# EAGLE design Power_Socket_nrf24_mini (EAGLE 6.2)
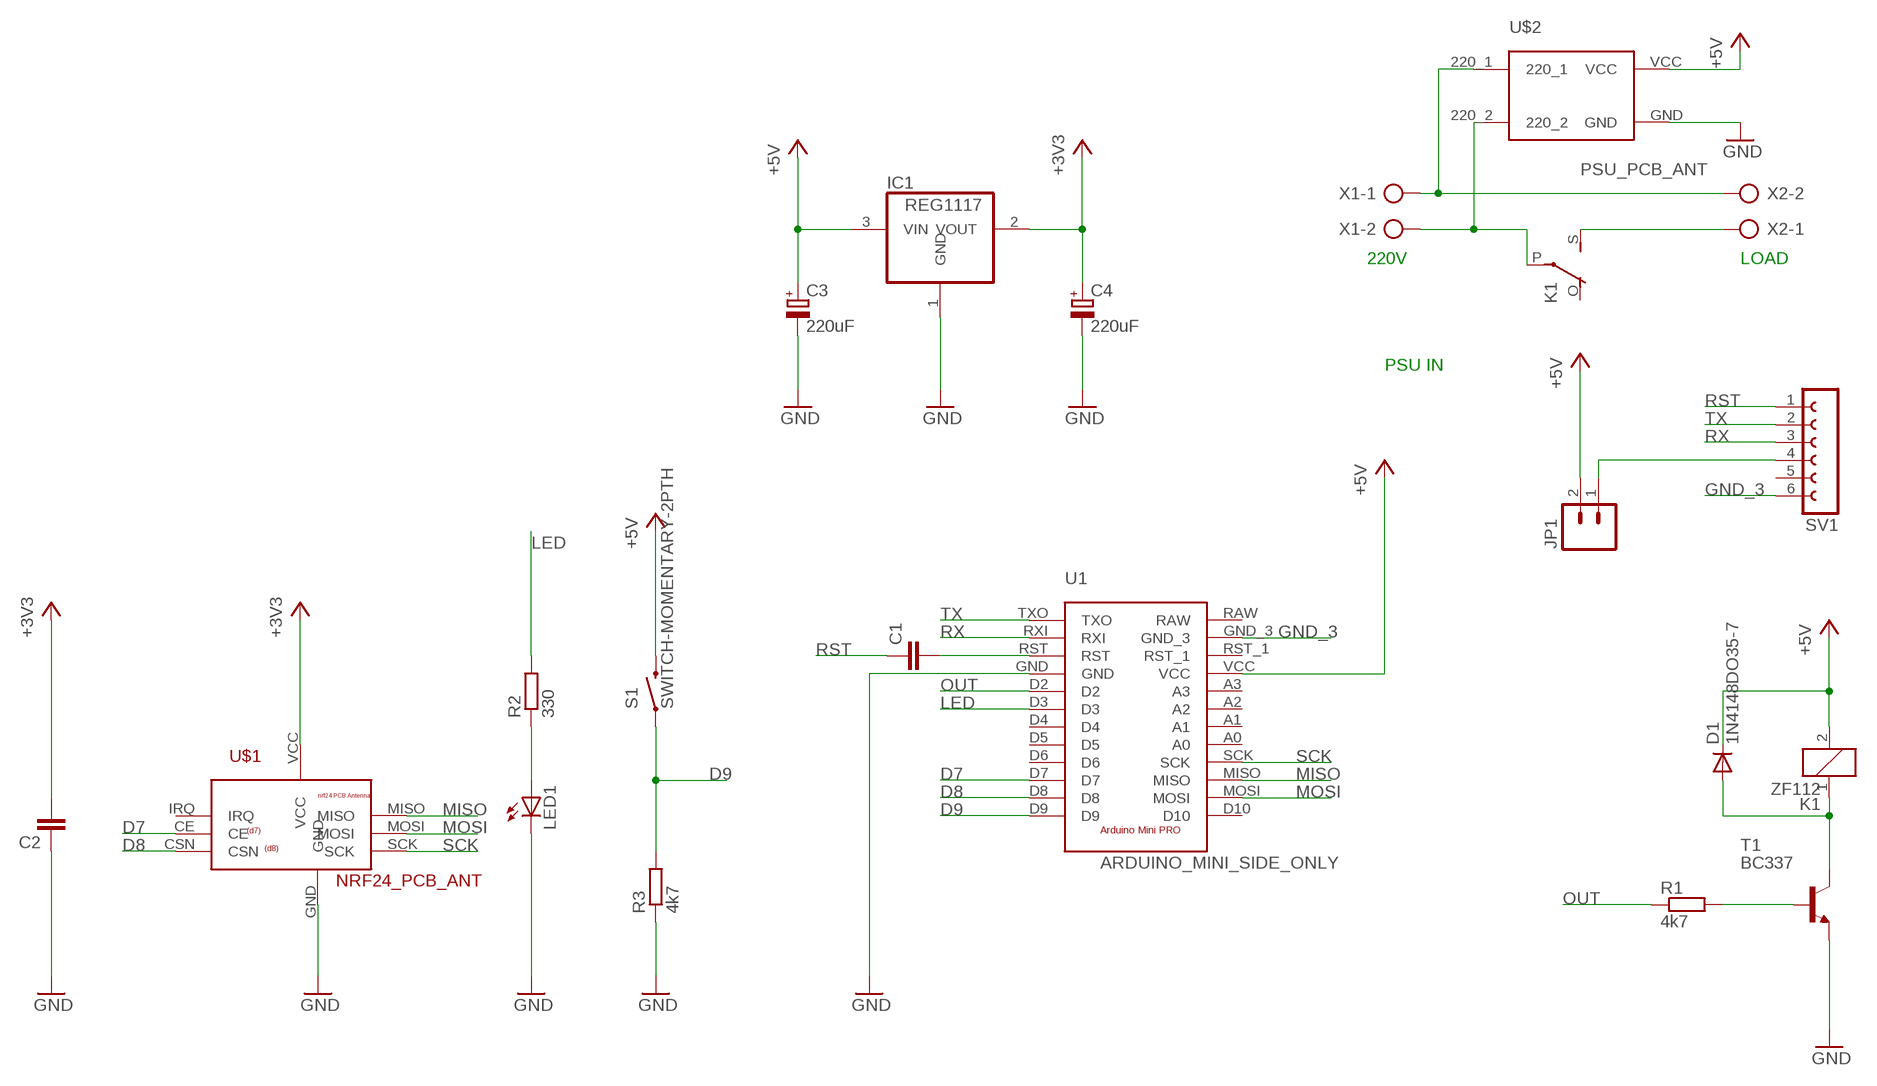
[diagram p0: schematic, sheet 1]

## Parts
C1  C-EUC1206  [C1206]
C2  C-EUC1206  [C1206]
C3  220uF  CPOL-EUE2.5-6  [E2,5-6]
C4  220uF  CPOL-EUE2.5-6  [E2,5-6]
D1  1N4148DO35-7  [DO35-7]
IC1  REG1117  [SOT223]
JP1  M02  [1X02_LONGPADS]
K1  ZF112  [ZF112]
LED1  LED3MM  [LED3MM]
R1  4k7  R-EU_0207/10  [0207/10]
R2  330  R-EU_0207/10  [0207/10]
R3  4k7  R-EU_0207/10  [0207/10]
S1  SWITCH-MOMENTARY-2PTH  [TACTILE-PTH]
SV1  FE06-1  [FE06]
T1  BC337  [TO92]
U1  ARDUINO_MINI_SIDE_ONLY  [ARDUINO_MINI_PRO_SIDE_ONLY]
U$1  NRF24_PCB_ANT  [NRF24_PCB_ANT]
U$2  PSU_PCB_ANT  [PSU_PCB_600MA]
X1  AK300/2  [AK300/2]
X2  AK300/2  [AK300/2]

## Nets
+3V3: C2.2 C4.+ IC1.2(VOUT) U$1.VCC
+5V: C3.+ D1.C IC1.3(VIN) JP1.2 K1.2 S1.3 U1.VCC U$2.VCC
D7: U1.D7 U$1.CE
D8: U1.D8 U$1.CSN
D9: R3.2 S1.1 U1.D9
GND: C2.1 C3.- C4.- IC1.1(GND) LED1.K(C) R3.1 T1.1(E) U1.GND U$1.GND U$2.GND
GND_3: SV1.6 U1.GND_3
LED: R2.2 U1.D3
MISO: U1.MISO U$1.MISO
MOSI: U1.MOSI U$1.MOSI
N$1: U$2.220_1 X1.1 X2.2
N$2: K1.P(2:P) U$2.220_2 X1.2
N$3: K1.S(2:S) X2.1
N$4: D1.A K1.1 T1.3(C)
N$5: R1.2 T1.2(B)
N$6: JP1.1 SV1.4
N$7: C1.2 U1.RST
N$8: LED1.A R2.1
OUT: R1.1 U1.D2
RST: C1.1 SV1.1
RX: SV1.3 U1.RXI
SCK: U1.SCK U$1.SCK
TX: SV1.2 U1.TXO
Unconnected: K1.O(2:O) SV1.5 U1.A0 U1.A1 U1.A2 U1.A3 U1.D4 U1.D5 U1.D6 U1.D10 U1.RAW U1.RST_1 U$1.IRQ

## Notes on the sheet
- 220V | LOAD
- PSU IN

## Library data of the parts
C1 C2 = resistor:C-EU: CAPACITOR, European symbol
C3 C4 = resistor:CPOL-EU: POLARIZED CAPACITOR, European symbol
D1 = diode:1N4148: DIODE high speed (Philips)
IC1 = burr-brown:REG1117: 800mA and 1A Low Dropout (LDO) Positive Regulator 1.8V, 2.5V, 2.85V, 3.3V, 5V, and Adj; MPN: REG1117; OC_FARNELL: 1097566; OC_NEWARK: 14P6981
JP1 = SparkFun:M02: Header 2 Standard 2-pin 0.1" header. Use with straight break away headers (SKU : PRT-00116), right angle break away headers (PRT-00553), swiss pins (PRT-00743), machine pins (PRT-00117), and female headers (PRT-00115). Molex polarized connector foot print use with SKU : PRT-08233 with associated crimp pins and housings.
K1 = relay:ZF112: RELAY 1 x switch; OC_FARNELL: unknown; OC_NEWARK: unknown
LED1 = led:LED: LED OSRAM: - CHIPLED LG R971, LG N971, LY N971, LG Q971, LY Q971, LO R971, LY R971 LH N974, LH R974 LS Q976, LO Q976, LY Q976 LO Q996 - Hyper CHIPLED LW Q18S LB Q993, LB Q99A, LB R99A - SideLED LS A670, LO A670, LY A670, LG A670, LP A670 LB A673, LV A673, LT A673, LW A673 LH A674 LY A675 LS A676, LA A676, LO A676, LY A676, LW A676 LS A679, LY A679, LG A679 - Hyper Micro SIDELED® LS Y876, LA Y876, LO Y876, LY Y876 LT Y87S - SmartLED LW L88C, LW L88S LB L89C, LB L89S, LG L890 LS L89K, LO L89K, LY L89K LS L896, LA L896, LO L896, LY L896 - TOPLED LS T670, LO T670, LY T670, LG T670, LP T670 LSG T670, LSP T670, LSY T670, LOP T670, LYG T670 LG T671, LOG T671, LSG T671 LB T673, LV T673, LT T673, LW T673 LH T674 LS T676, LA T676, LO T676, LY T676, LB T676, LH T676, LSB T676, LW T676 LB T67C, LV T67C, LT T67C, LS T67K, LO T67K, LY T67K, LW E67C LS E67B, LA E67B, LO E67B, LY E67B, LB E67C, LV E67C, LT E67C LW T67C LS T679, LY T679, LG T679 LS T770, LO T770, LY T770, LG T770, LP T770 LB T773, LV T773, LT T773, LW T773 LH T774 LS E675, LA E675, LY E675, LS T675 LS T776, LA T776, LO T776, LY T776, LB T776 LHGB T686 LT T68C, LB T68C - Hyper Mini TOPLED® LB M676 - Mini TOPLED Santana® LG M470 LS M47K, LO M47K, LY M47K Source: http://www.osram.convergy.de LUXEON: - LUMILED® LXK2-PW12-R00, LXK2-PW12-S00, LXK2-PW14-U00, LXK2-PW14-V00 LXK2-PM12-R00, LXK2-PM12-S00, LXK2-PM14-U00 LXK2-PE12-Q00, LXK2-PE12-R00, LXK2-PE12-S00, LXK2-PE14-T00, LXK2-PE14-U00 LXK2-PB12-K00, LXK2-PB12-L00, LXK2-PB12-M00, LXK2-PB14-N00, LXK2-PB14-P00, LXK2-PB14-Q00 LXK2-PR12-L00, LXK2-PR12-M00, LXK2-PR14-Q00, LXK2-PR14-R00 LXK2-PD12-Q00, LXK2-PD12-R00, LXK2-PD12-S00 LXK2-PH12-R00, LXK2-PH12-S00 LXK2-PL12-P00, LXK2-PL12-Q00, LXK2-PL12-R00 Source: www.luxeon.com KINGBRIGHT: KA-3528ASYC Source: www.kingbright.com
R1-R3 = resistor:R-EU_: RESISTOR, European symbol
S1 = SparkFun:SWITCH-MOMENTARY-2
SV1 = con-lsta:FE06-1: FEMALE HEADER; OC_FARNELL: unknown; OC_NEWARK: unknown
T1 = transistor:BC337: NPN TRANSISTOR
U1 = MyArduino:ARDUINO_MINI_SIDE_ONLY
U$1 = my_components:NRF24_PCB_ANT
U$2 = my_components:PSU_PCB_ANT
X1 X2 = con-ptr500:AK300/2: CONNECTOR; OC_FARNELL: unknown; OC_NEWARK: unknown

## Board
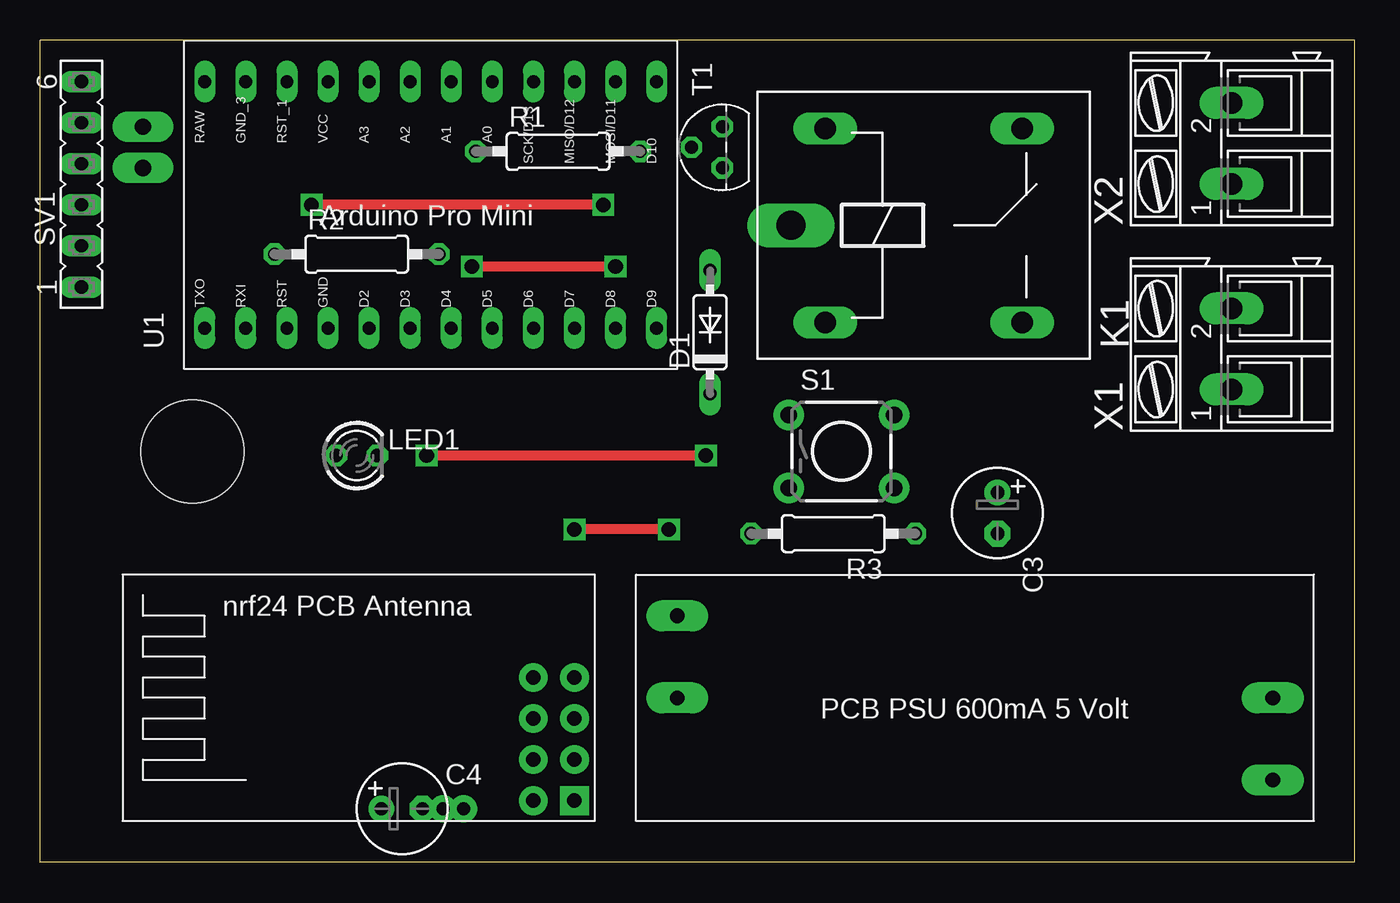
[diagram p1: board, top side]
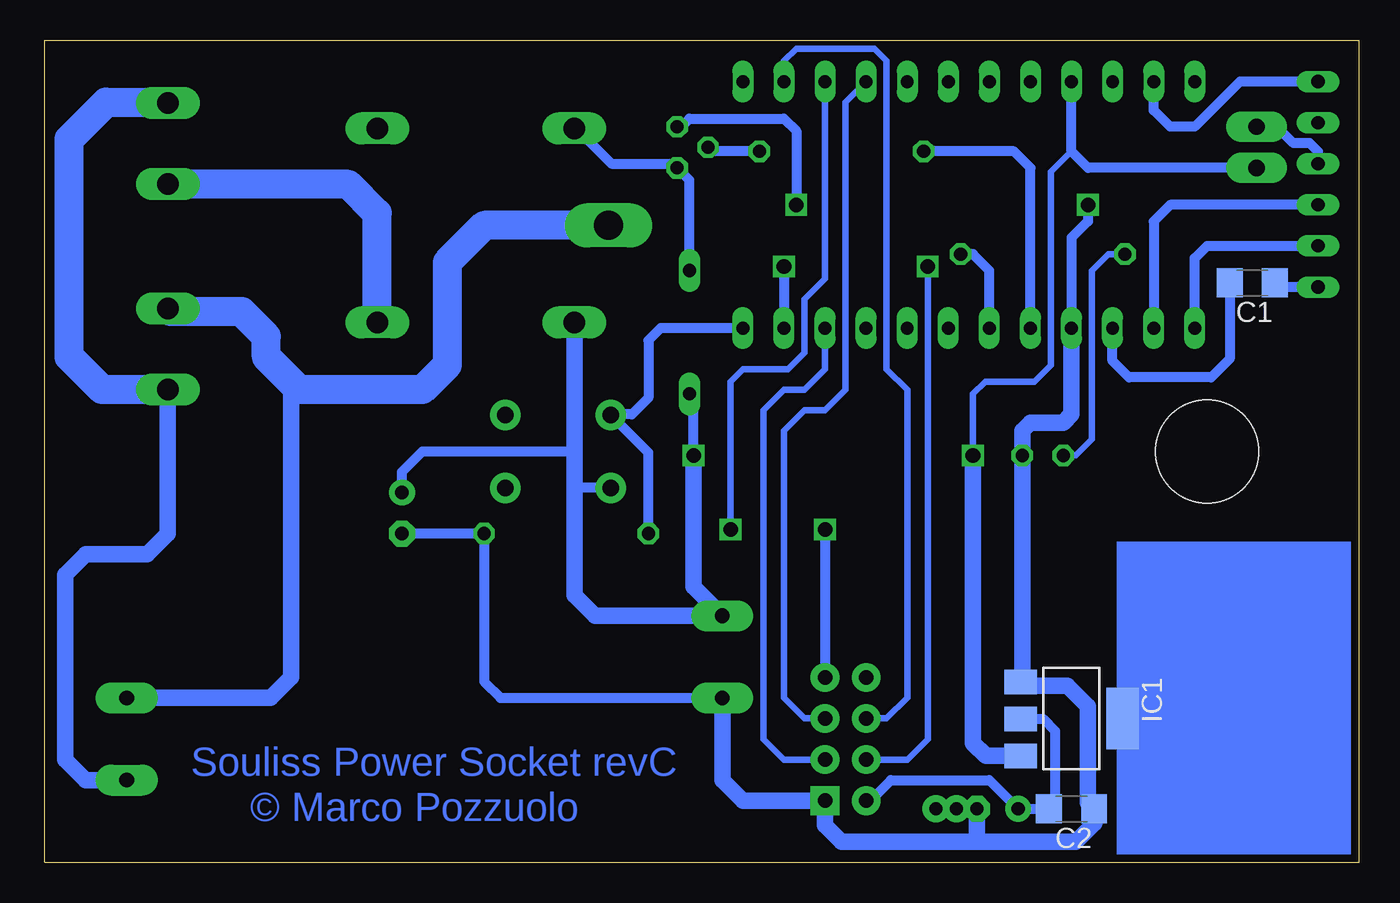
[diagram p2: board, bottom side, seen from below]

Size 81.28 x 50.8 mm. Coordinates in mm from the lower left corner, seen from the top.
Outline: 81.28,0 0,0 0,50.8 81.28,50.8 81.28,0
Copper layers (1*16): Top 0.035mm / dielectric 1.5mm / Bottom 0.035mm
Design rules: minimum track width 10mil, minimum drill 24mil, track to track 8mil, track to pad 8mil, pad to pad 8mil, via to via 8mil, smd to smd 8mil, copper to edge 40mil, drill to drill 8mil, minimum pad ring 10mil, minimum via ring 8mil, stop-mask expansion 4mil, vias tented up to drill 0mil, thermal gap 10mil
Holes 6.35 mm at 9.4,25.4

### Footprints (pad centres in the part's own frame; a part is rotated, then mirrored left to right if it is on the bottom)
C1206 = smd 1.6 x 1.8: 1 -1.4,0; 2 1.4,0
E2,5-6 = drill 0.813 pad 1.6: + -1.27,0 | drill 0.813 pad 1.6 octagon: - 1.27,0
DO35-7 = drill 0.813 long: A 3.81,0; C -3.81,0
SOT223 = smd 1.499 x 2.007: 1 -2.261,-3.15; 2 0.025,-3.15; 3 2.311,-3.15 | smd 3.81 x 2.007: 4 0,3.15
1X02_LONGPADS = drill 1.016 pad 1.88 long: 1 0,0; 2 2.54,0
ZF112 = drill 1.321 long: 1 -6.096,5.994; 2 -6.096,-5.994; O 6.096,5.994; S 6.096,-5.994 | drill 1.803 long: P -8.204,0
LED3MM = drill 0.813 octagon: A -1.27,0; K 1.27,0
0207/10 = drill 0.813 octagon: 1 -5.08,0; 2 5.08,0
TACTILE-PTH = drill 1.016 pad 1.88: 1 -3.251,2.261; 2 3.251,2.261; 3 -3.251,-2.261; 4 3.251,-2.261
FE06 = drill 0.813 long: 1 -6.35,0; 2 -3.81,0; 3 -1.27,0; 4 1.27,0; 5 3.81,0; 6 6.35,0
TO92 = drill 0.813 octagon: 1 1.27,0; 2 0,1.905; 3 -1.27,0
ARDUINO_MINI_PRO_SIDE_ONLY = drill 0.8 long: A0 7.62,0; A1 7.62,2.54; A2 7.62,5.08; A3 7.62,7.62; D2 -7.62,7.62; D3 -7.62,5.08; D4 -7.62,2.54; D5 -7.62,0; D6 -7.62,-2.54; D7 -7.62,-5.08; D8 -7.62,-7.62; D9 -7.62,-10.16; D10 7.62,-10.16; GND -7.62,10.16; GND_3 7.62,15.24; MISO 7.62,-5.08; MOSI 7.62,-7.62; RAW 7.62,17.78; RST -7.62,12.7; RST_1 7.62,12.7; RXI -7.62,15.24; SCK 7.62,-2.54; TXO -7.62,17.78; VCC 7.62,10.16
NRF24_PCB_ANT = drill 0.9 pad 1.778: CE -6.35,1.27; CSN -3.81,1.27; IRQ -3.81,-3.81; MISO -6.35,-3.81; MOSI -3.81,-1.27; SCK -6.35,-1.27; VCC -3.81,3.81 | drill 0.9 pad 1.778 square: GND -6.35,3.81
PSU_PCB_600MA = drill 0.9 pad 1.93 long: 220_1 2.54,2.54; 220_2 7.62,2.54; GND 7.62,39.37; VCC 12.7,39.37
AK300/2 = drill 1.321 long: 1 -2.515,0; 2 2.489,0

### Placement (x,y rotation side)
C1  6.6,35.81 180 bottom
C2  17.78,3.3 180 bottom
C3  59.18,21.59 270 top
C4  22.35,3.3 0 top
D1  41.4,32.77 90 top
IC1  17.78,8.89 270 bottom
JP1  6.35,45.47 270 top
K1  54.61,39.37 0 top
LED1  19.56,25.15 0 top
R1  32,43.94 0 top
R2  19.56,37.59 0 top
R3  49.02,20.32 180 top
S1  49.53,25.4 0 top
SV1  2.54,41.91 90 top
T1  42.16,44.2 90 top
U1  27.94,40.64 90 top
U$1  26.67,7.62 180 top
U$2  78.74,2.54 90 top
X1  73.66,31.75 90 top
X2  73.66,44.45 90 top

### Tracks (layer width: path | path; a pad name or v marks a point on that pad's centre or on a via)
+3V3
  Bottom 0.61: IC1.2 19.53,8.87 18.8,8.13 18.8,3.69 C2.2 | 19.69,3.81 C2.2 | C2.2 C4.+ 22.86,5.08 28.96,5.08 30.23,3.81 U$1.VCC
+5V  (via drill 0.9)
  Top 0.61: v23.88,25.15 v41.15,25.15
  Bottom 0.406: v23.88,25.15 23.88,28.96 23.11,29.72 20.07,29.72 19.05,30.73 19.05,42.67 17.78,43.94
  Bottom 0.61: JP1.2 16.76,42.93 17.78,43.94 U1.VCC | 48.36,33.53 K1.2 | v41.15,25.15 41.15,28.7 D1.C | S1.3 48.29,23.14 48.51,23.37 | C3.+ 59.18,24.13 57.91,25.4 48.51,25.4
  Bottom 1.016: IC1.3 23.09,6.58 23.88,7.37 v23.88,25.15 | v41.15,25.15 41.15,17.02 U$2.VCC 47.24,15.24 48.51,16.51 48.51,23.37 48.51,25.4 K1.2
D7
  Bottom 0.406: U$1.CE 35.56,6.35 36.83,7.62 36.83,27.94 35.56,29.21 34.29,29.21 33.02,30.48 U1.D7
D8  (via drill 0.9)
  Top 0.61: v26.67,36.83 v35.56,36.83
  Bottom 0.406: U$1.CSN 27.94,6.35 26.67,7.62 v26.67,36.83
  Bottom 0.61: v35.56,36.83 U1.D8
D9
  Bottom 0.61: U1.D9 43.18,33.02 43.94,32.26 43.94,28.7 44.96,27.69 46.25,27.69 S1.1 43.94,25.32 R3.2
GND  (via drill 0.9)
  Top 0.61: v34.8,40.64 v16.76,40.64
  Bottom 0.61: 20.83,11.25 IC1.1 | T1.1 41.91,45.47 41.4,45.97 35.56,45.97 34.8,45.21 v34.8,40.64 | v16.76,40.64 16.76,39.62 17.78,38.61 U1.GND | U$2.GND 53.09,10.16 54.1,11.18 R3.1 C3.-
  Bottom 1.016: U$2.GND 39.37,5.08 38.1,3.81 U$1.GND 33.02,2.29 32,1.27 23.62,1.27 | 20.9,11.18 IC1.1 20.7,10.92 18.03,10.92 16.76,9.65 16.76,3.69 C2.1 16.38,2.42 17.53,1.27 23.62,1.27 | 20.83,11.25 LED1.K 20.83,26.67 20.32,27.18 18.29,27.18 17.78,27.69 U1.GND | C4.- 23.62,1.27
GND_3
  Bottom 0.61: SV1.6 7.37,48.26 10.16,45.47 11.68,45.47 12.7,46.48 U1.GND_3
LED
  Bottom 0.61: U1.D3 22.86,36.58 23.88,37.59 R2.2
MISO  (via drill 0.9)
  Top 0.61: v38.86,20.57 v33.02,20.57
  Bottom 0.406: v38.86,20.57 38.86,29.72 38.1,30.48 35.31,30.48 34.29,31.5 34.29,34.8 33.02,36.07 U1.MISO
  Bottom 0.61: v33.02,20.57 U$1.MISO
MOSI
  Bottom 0.406: U$1.MOSI 29.21,8.89 27.94,10.16 27.94,29.21 29.21,30.48 29.21,49.53 29.97,50.29 34.8,50.29 35.56,49.53 U1.MOSI
N$1
  Bottom 1.016: U$2.220_1 78.74,5.08 80.01,6.35 80.01,17.78 78.74,19.05 74.93,19.05 73.66,20.32 X1.1 73.69,29.21
  Bottom 1.778: 73.69,29.21 77.72,29.21 79.76,31.24 79.76,44.7 77.47,46.99 73.71,46.99 X2.2
N$2
  Bottom 1.016: U$2.220_2 67.31,10.16 66.04,11.43 66.04,29.21 65.79,29.46
  Bottom 1.778: K1.P 54.1,39.37 56.39,37.08 56.39,30.73 57.91,29.21 65.53,29.21 65.79,29.46 67.56,31.24 67.56,32.51 69.09,34.04 73.46,34.04 X1.2
N$3
  Bottom 1.778: K1.S 60.71,40.13 62.48,41.91 73.64,41.91 X2.1
N$4
  Bottom 0.61: K1.1 48.41,45.47 48.41,45.36 46.23,43.18 42.42,43.18 T1.3 41.4,42.16 D1.A
N$5
  Bottom 0.61: R1.2 40.01,43.94 T1.2
N$6
  Bottom 0.61: SV1.4 2.54,43.94 3.05,44.45 4.06,44.45 5.08,45.47 JP1.1
N$7
  Bottom 0.61: C1.2 8,31.11 9.14,29.97 14.22,29.97 15.24,30.99 U1.RST
N$8
  Bottom 0.406: R2.1 15.49,37.59 16.51,36.58 16.51,26.16 17.53,25.15 LED1.A
N$9  (via drill 0.8 pad 1.68)
  other vias: 24.89,3.3
N$10  (via drill 0.8 pad 1.68)
  other vias: 26.16,3.3
N$11  (via drill 3.2 pad 6.45)
  other vias: 9.4,25.4
OUT
  Bottom 0.61: U1.D2 20.32,42.93 21.34,43.94 R1.1
RST
  Bottom 0.61: SV1.1 4.95,35.56 C1.1
RX
  Bottom 0.61: SV1.3 11.68,40.64 12.7,39.62 U1.RXI
SCK
  Bottom 0.406: U$1.SCK 34.29,8.89 35.56,10.16 35.56,26.67 34.29,27.94 33.02,27.94 31.75,29.21 31.75,46.99 U1.SCK
TX
  Bottom 0.61: U1.TXO 10.16,37.34 9.4,38.1 SV1.2
(copper drawn outside any net)
  shapes: Bottom area x1

### Text on the board
Bottom: Souliss Power Socket revC | © Marco Pozzuolo